# Altium schematic sheet LED_text_screen_concept.SchDoc
size 889 x 355 mm; SheetNumber: 0; SheetTotal: 0
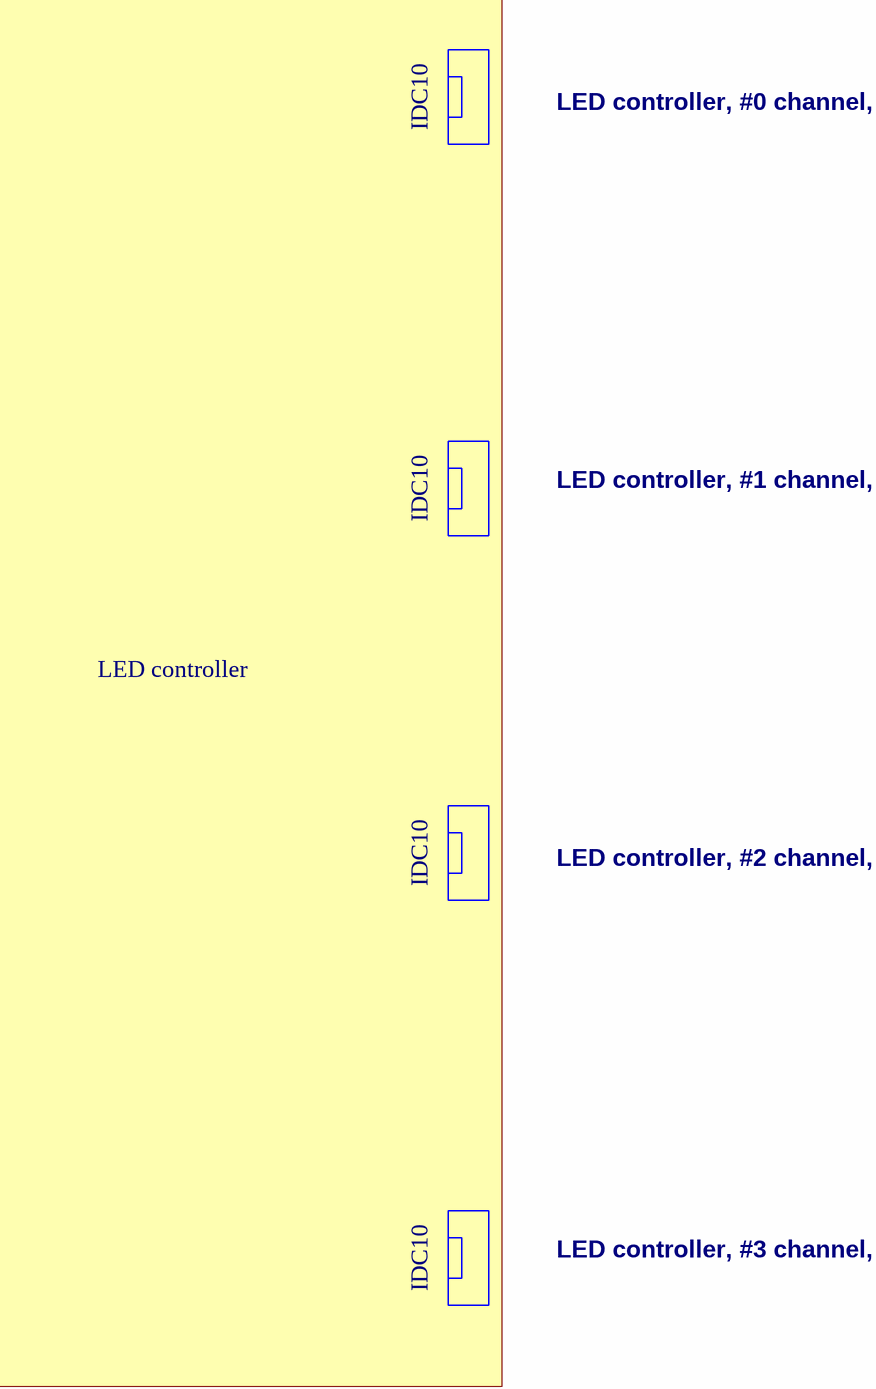
[diagram p0: LED_text_screen_concept.SchDoc, left]
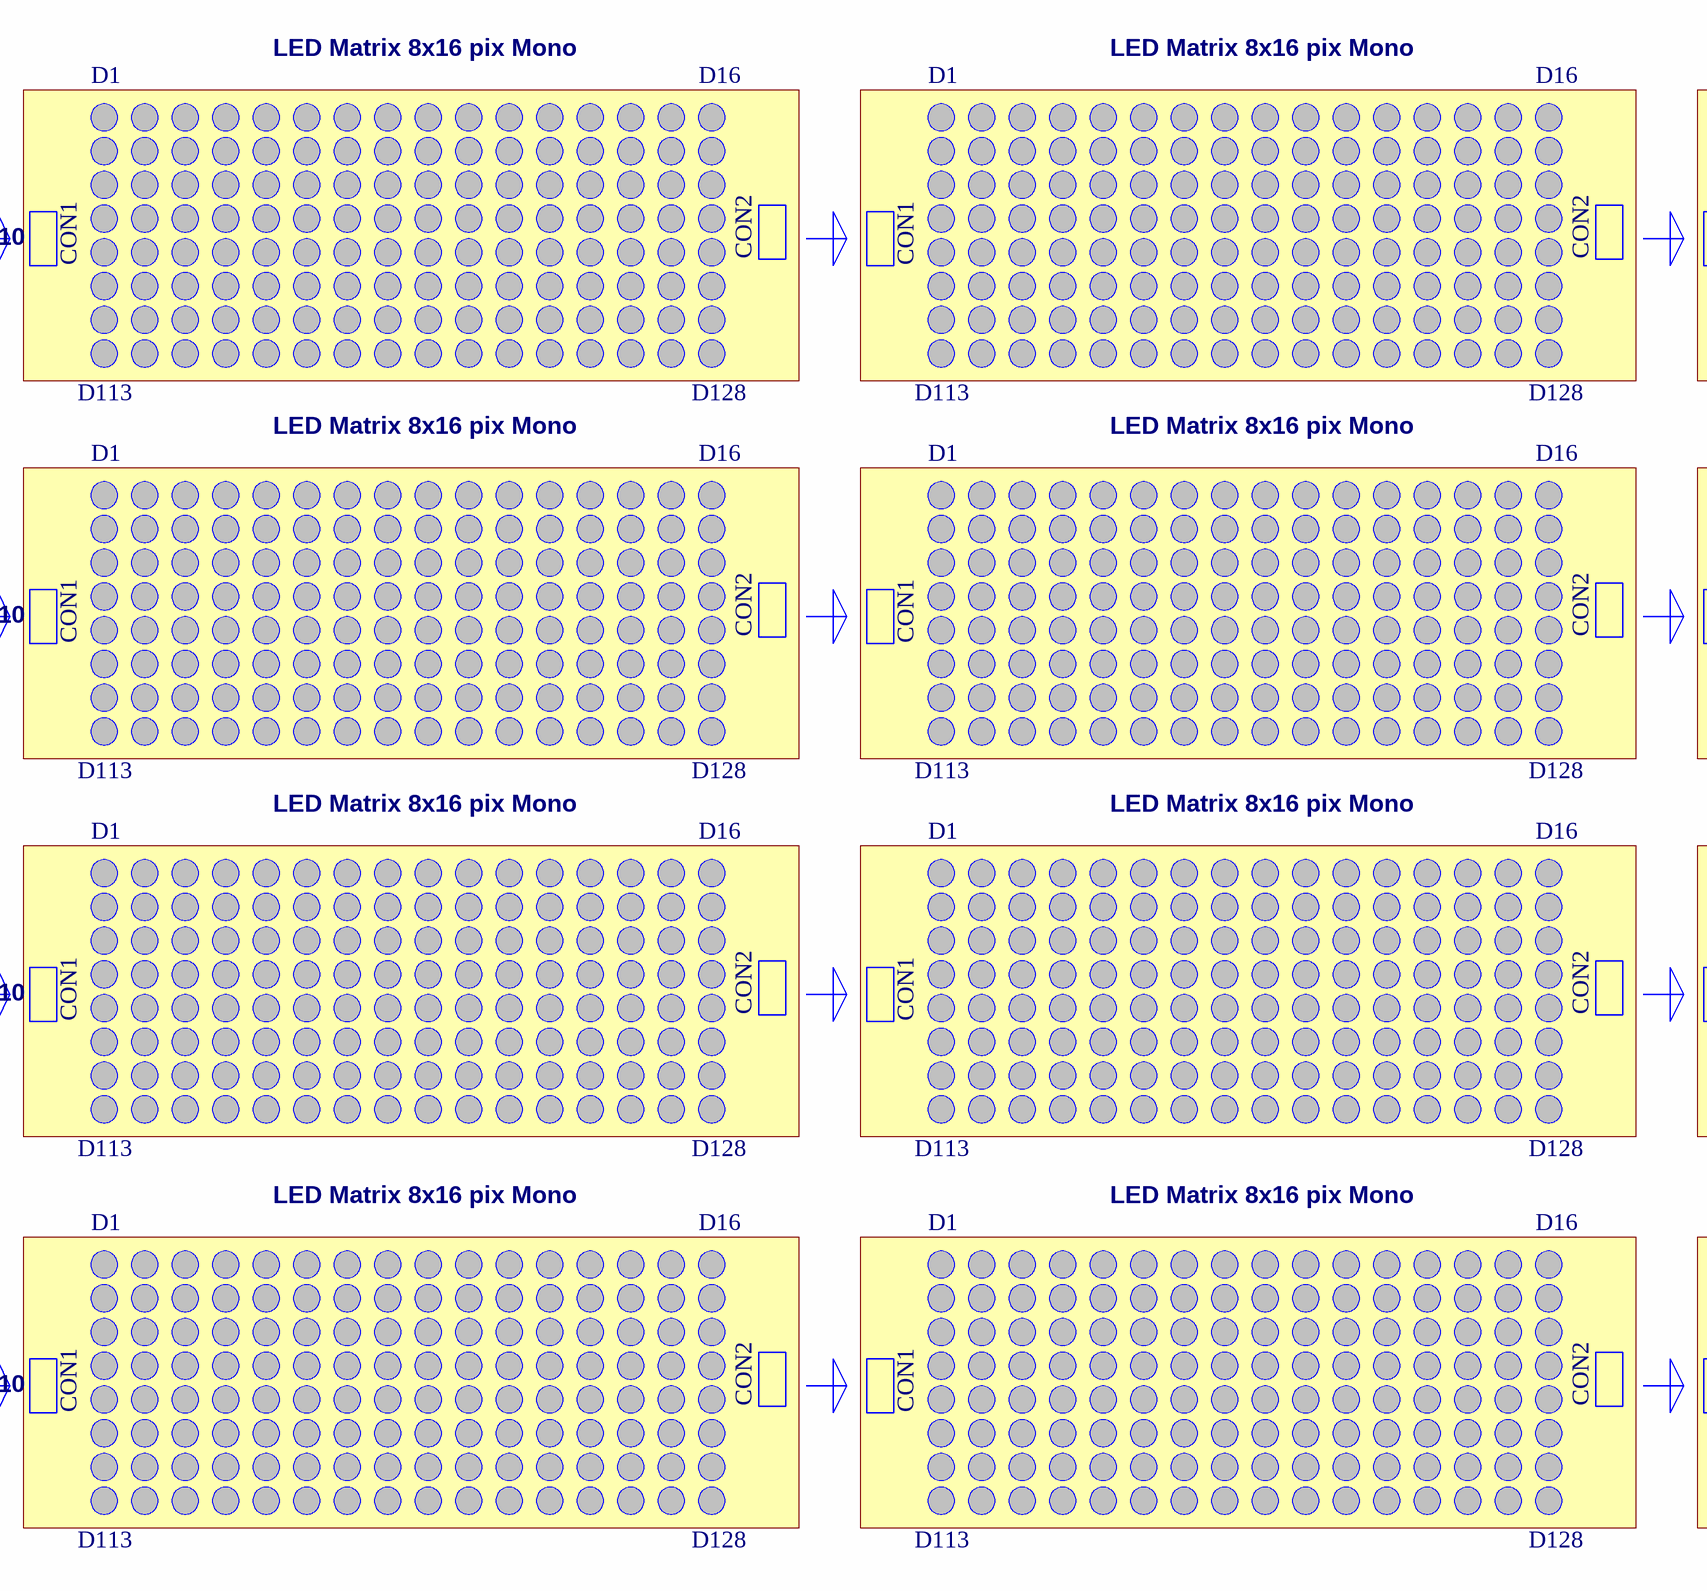
[diagram p1: LED_text_screen_concept.SchDoc, middle]
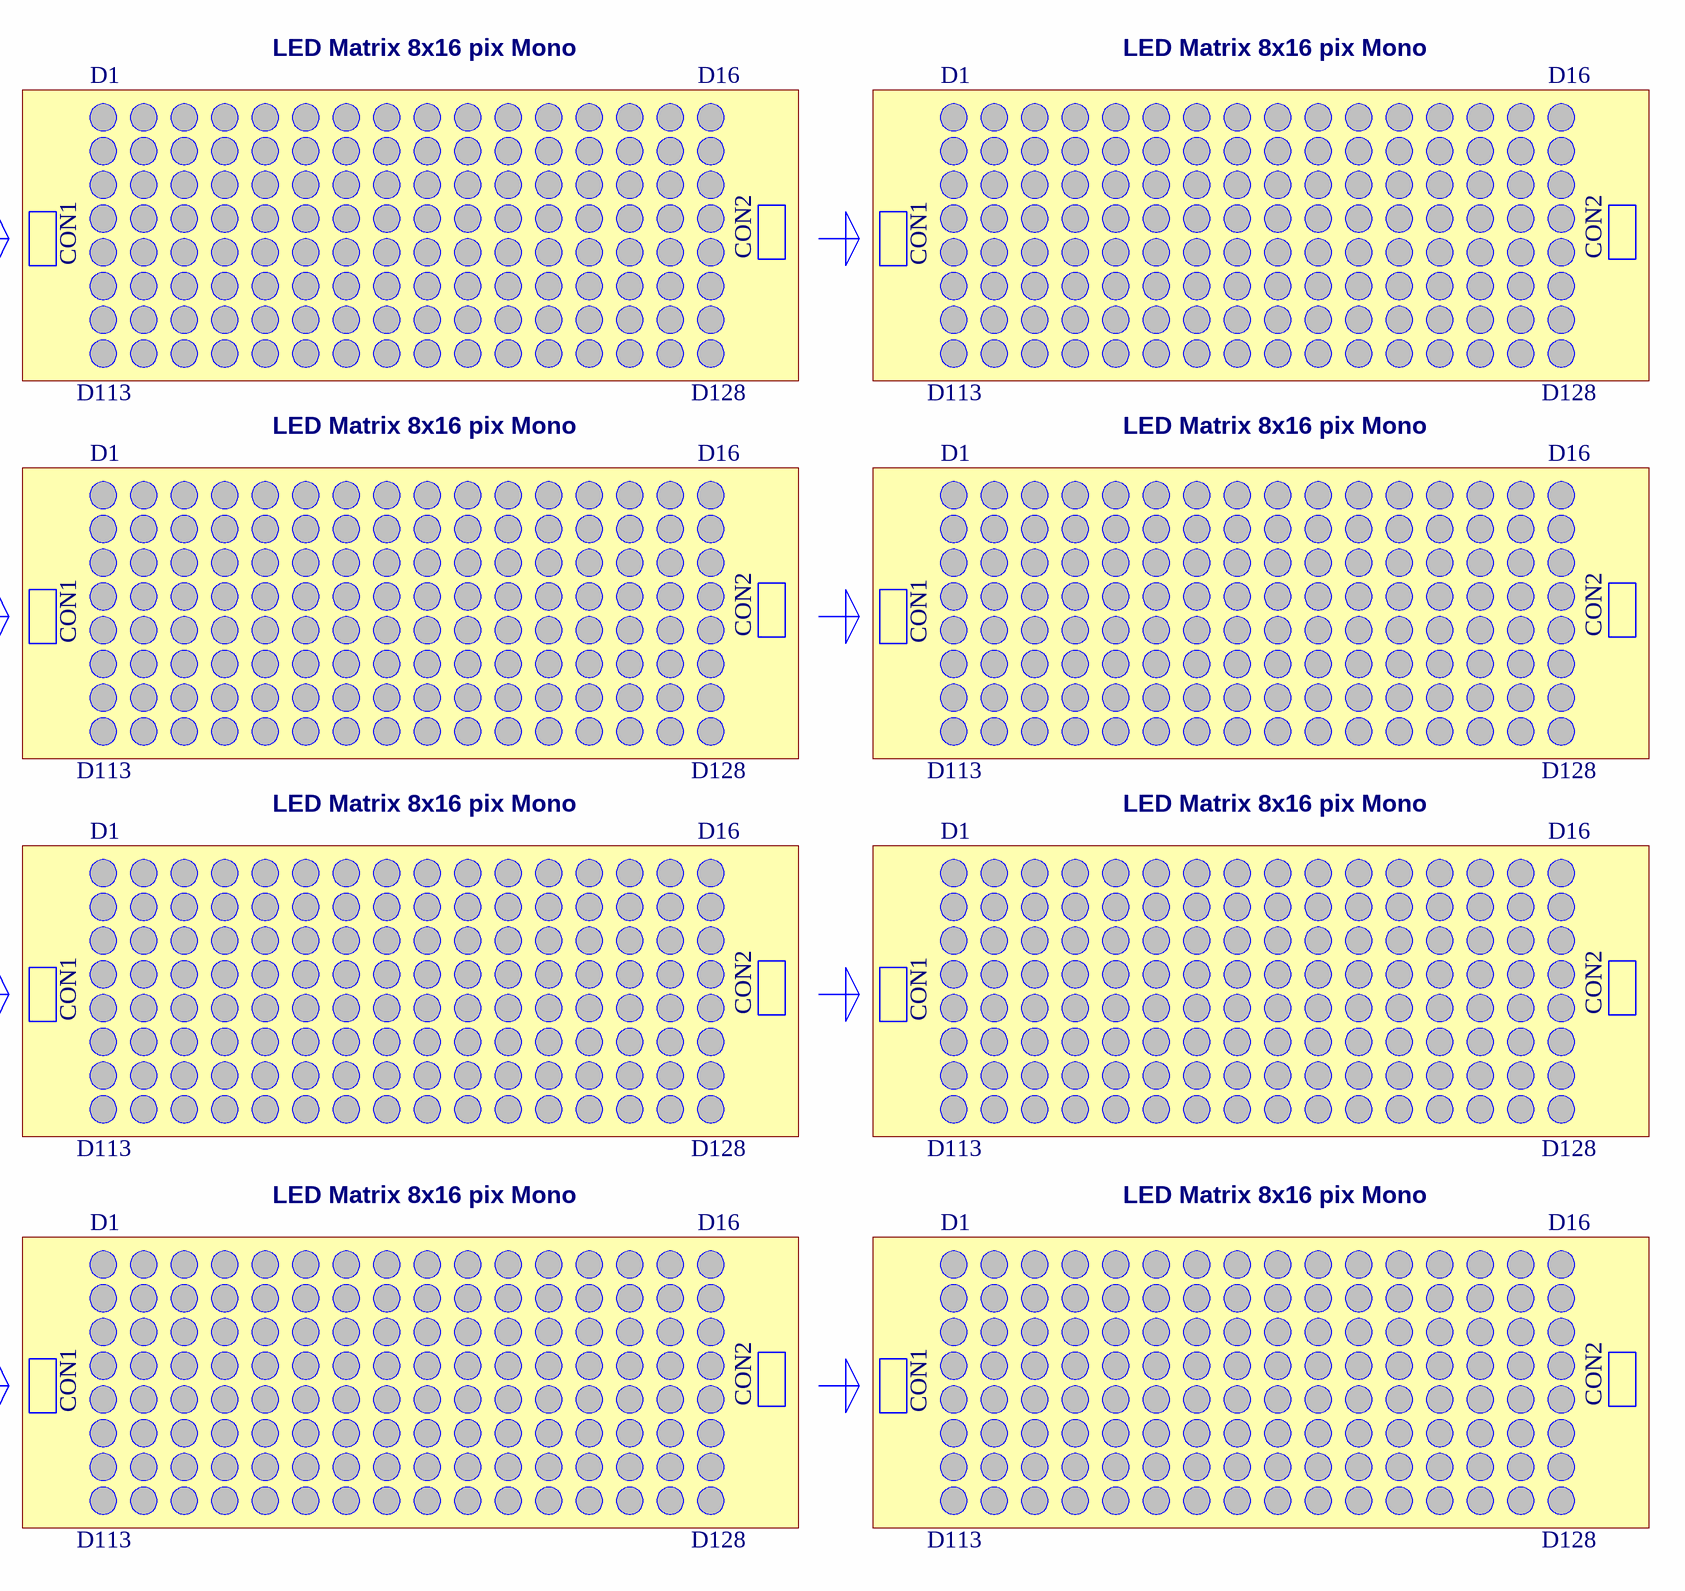
[diagram p2: LED_text_screen_concept.SchDoc, right]

## Notes on the sheet
- LED Matrix 8x16 pix Mono
- D1
- D16
- IDC10
- LED controller, #0 channel, IDC10
- CON1
- CON2
- D113
- D128
- LED controller, #1 channel, IDC10
- LED controller
- LED controller, #2 channel, IDC10
- LED controller, #3 channel, IDC10